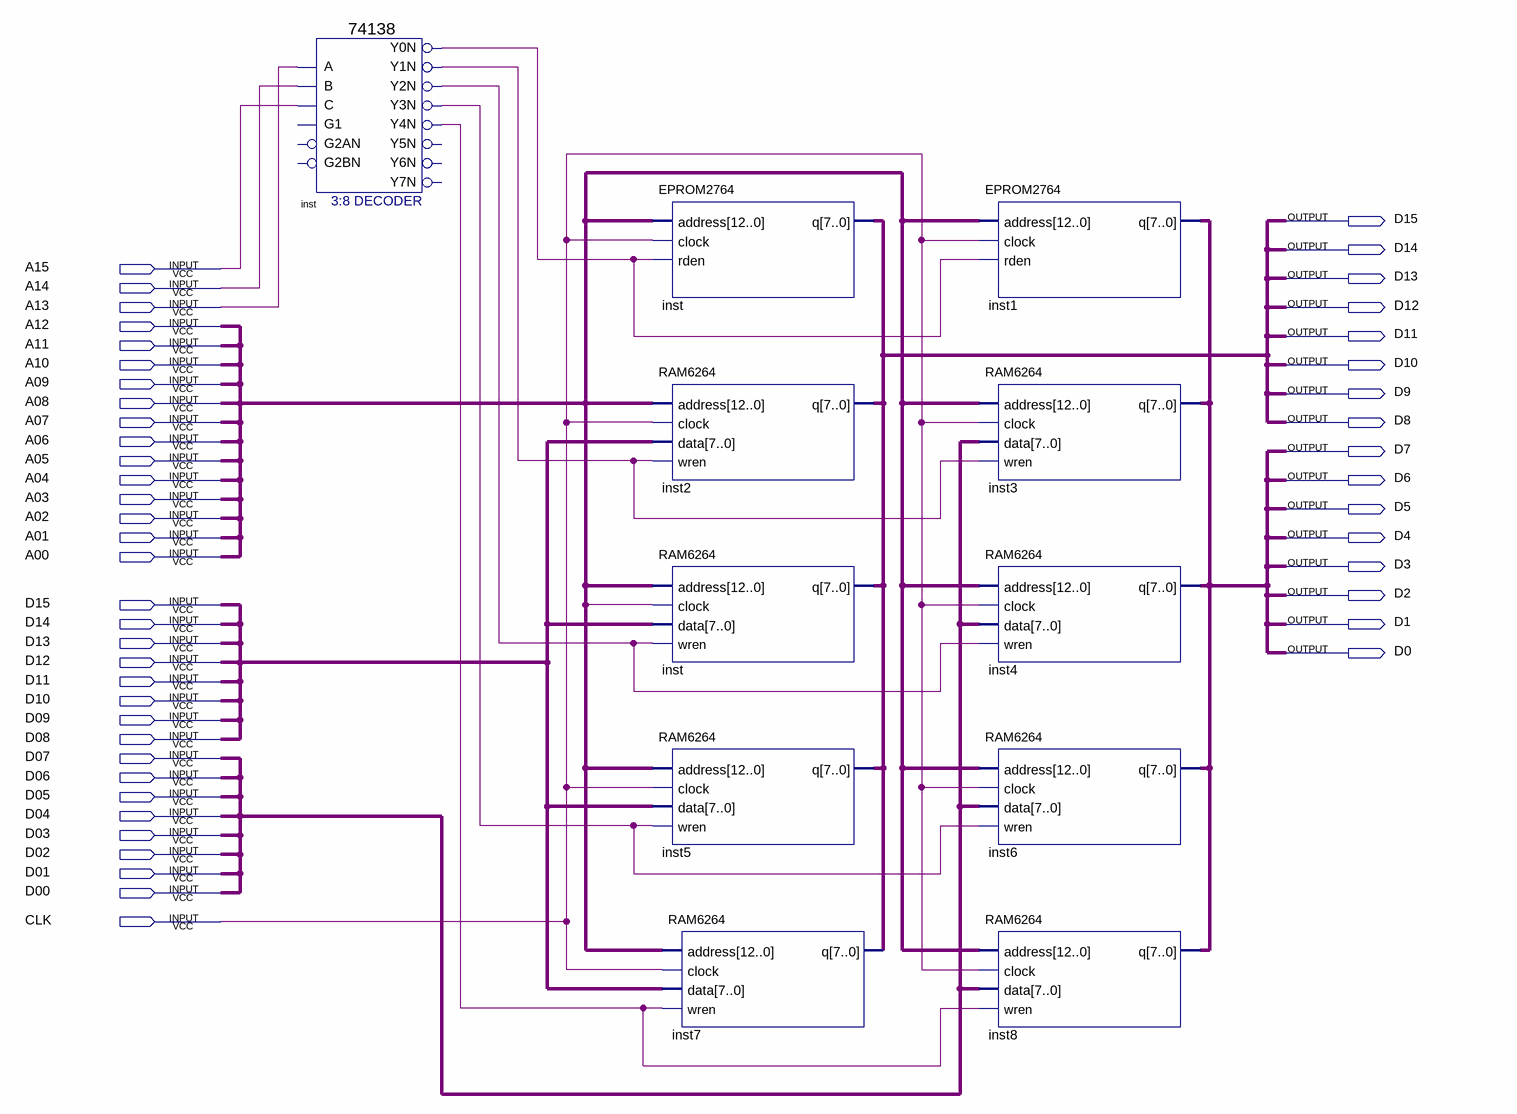
[diagram p0: schematic sheet]
// Quartus schematic mystorage.bdf as structural Verilog: 11 symbols, 49 pins
module mystorage (
  input  A15,
  input  A14,
  input  A13,
  input  A12,
  input  A11,
  input  A10,
  input  A09,
  input  A08,
  input  A07,
  input  A06,
  input  A05,
  input  A04,
  input  A03,
  input  A02,
  input  A01,
  input  A00,
  inout  D15,
  inout  D14,
  inout  D13,
  inout  D12,
  inout  D11,
  inout  D10,
  input  D09,
  input  D08,
  input  D07,
  input  D06,
  input  D05,
  input  D04,
  input  D03,
  input  D02,
  input  D01,
  input  D00,
  input  CLK,
  output D9,
  output D8,
  output D7,
  output D6,
  output D5,
  output D4,
  output D3,
  output D2,
  output D1,
  output D0
);

  wire inst_y0n, inst_y1n, inst_y2n, inst_y3n, inst_y4n, undriven;
  wire [7:0] inst1_q, inst_q, undriven_2, undriven_3;
  wire [12:0] undriven_4;

  \74138  inst (
    .A(A13), .B(A14), .C(A15), .Y0N(inst_y0n), .Y1N(inst_y1n), .Y2N(inst_y2n), .Y3N(inst_y3n), .Y4N(inst_y4n));  // open: G1, G2AN, G2BN, Y5N, Y6N, Y7N
  EPROM2764 inst_dup2 (.address(undriven_4), .clock(CLK), .rden(inst_y0n), .q(inst_q));
  RAM6264 inst2 (.address(undriven_4), .clock(CLK), .data(undriven_3), .wren(inst_y1n), .q(inst_q));
  RAM6264 inst_dup3 (.address(undriven_4), .clock(undriven), .data(undriven_3), .wren(inst_y2n), .q(inst_q));
  RAM6264 inst5 (.address(undriven_4), .clock(CLK), .data(undriven_3), .wren(inst_y3n), .q(inst_q));
  RAM6264 inst7 (.address(undriven_4), .clock(CLK), .data(undriven_3), .wren(inst_y4n), .q(inst_q));
  EPROM2764 inst1 (.address(undriven_4), .clock(CLK), .rden(inst_y0n), .q(inst1_q));
  RAM6264 inst3 (.address(undriven_4), .clock(CLK), .data(undriven_2), .wren(inst_y1n), .q(inst1_q));
  RAM6264 inst4 (.address(undriven_4), .clock(CLK), .data(undriven_2), .wren(inst_y2n), .q(inst1_q));
  RAM6264 inst6 (.address(undriven_4), .clock(CLK), .data(undriven_2), .wren(inst_y3n), .q(inst1_q));
  RAM6264 inst8 (.address(undriven_4), .clock(CLK), .data(undriven_2), .wren(inst_y4n), .q(inst1_q));
endmodule
